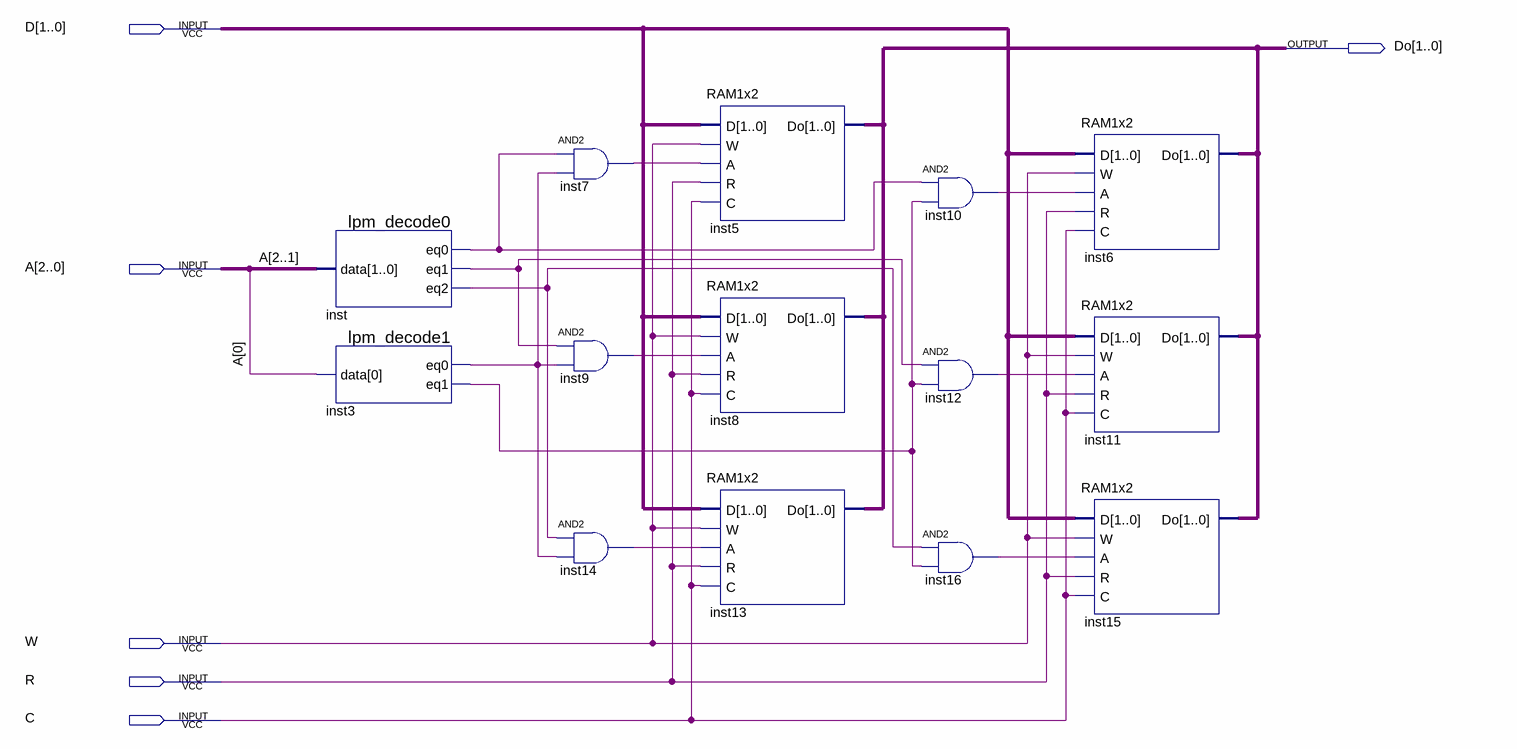
[diagram p0: schematic sheet]
// Quartus schematic RAM6x2.bdf as structural Verilog: 14 symbols, 6 pins
module RAM6x2 (
  input  [1:0] D,
  input  [2:0] A,
  input  W,
  input  R,
  input  C,
  output [1:0] Do
);

  wire inst3_eq0, inst3_eq1, inst7_out, inst9_out, inst10_out, inst12_out, inst14_out, inst16_out, inst_eq0,
       inst_eq1, inst_eq2;

  lpm_decode0 inst (.data(A[2:1]), .eq0(inst_eq0), .eq1(inst_eq1), .eq2(inst_eq2));
  lpm_decode1 inst3 (.data(A[0]), .eq0(inst3_eq0), .eq1(inst3_eq1));
  and inst7 (inst7_out, inst_eq0, inst3_eq0);
  and inst9 (inst9_out, inst_eq1, inst3_eq0);
  and inst14 (inst14_out, inst_eq2, inst3_eq0);
  RAM1x2 inst5 (.D(D), .W(W), .A(inst7_out), .R(R), .C(C), .Do(Do));
  RAM1x2 inst8 (.D(D), .W(W), .A(inst9_out), .R(R), .C(C), .Do(Do));
  RAM1x2 inst13 (.D(D), .W(W), .A(inst14_out), .R(R), .C(C), .Do(Do));
  and inst10 (inst10_out, inst_eq0, inst3_eq1);
  and inst12 (inst12_out, inst_eq1, inst3_eq1);
  and inst16 (inst16_out, inst_eq2, inst3_eq1);
  RAM1x2 inst6 (.D(D), .W(W), .A(inst10_out), .R(R), .C(C), .Do(Do));
  RAM1x2 inst11 (.D(D), .W(W), .A(inst12_out), .R(R), .C(C), .Do(Do));
  RAM1x2 inst15 (.D(D), .W(W), .A(inst16_out), .R(R), .C(C), .Do(Do));
endmodule
